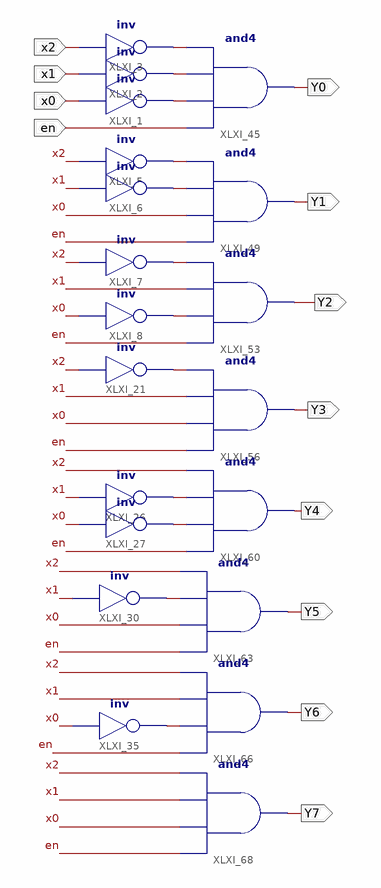
[diagram p0: schematic sheet 1]
// Xilinx ISE schematic decoder_3_to_8_en.sch (virtex6) as structural Verilog: 20 symbols, 12 ports
module decoder_3_to_8_en (
  input  x0,
  input  x1,
  input  x2,
  input  en,
  output Y0,
  output Y1,
  output Y2,
  output Y3,
  output Y4,
  output Y5,
  output Y6,
  output Y7
);

  wire XLXN_1, XLXN_2, XLXN_3, XLXN_5, XLXN_6, XLXN_7, XLXN_9, XLXN_14, XLXN_17, XLXN_30, XLXN_43, XLXN_89;

  not XLXI_1 (XLXN_3, x0);
  not XLXI_2 (XLXN_5, x1);
  not XLXI_3 (XLXN_6, x2);
  and XLXI_45 (Y0, en, XLXN_3, XLXN_5, XLXN_6);
  not XLXI_5 (XLXN_1, x2);
  not XLXI_6 (XLXN_2, x1);
  not XLXI_7 (XLXN_7, x2);
  not XLXI_8 (XLXN_9, x0);
  and XLXI_49 (Y1, en, x0, XLXN_2, XLXN_1);
  and XLXI_53 (Y2, en, XLXN_9, x1, XLXN_7);
  not XLXI_21 (XLXN_89, x2);
  not XLXI_26 (XLXN_14, x1);
  not XLXI_27 (XLXN_30, x0);
  and XLXI_56 (Y3, en, x0, x1, XLXN_89);
  not XLXI_30 (XLXN_17, x1);
  not XLXI_35 (XLXN_43, x0);
  and XLXI_63 (Y5, en, x0, XLXN_17, x2);
  and XLXI_66 (Y6, en, XLXN_43, x1, x2);
  and XLXI_68 (Y7, en, x0, x1, x2);
  and XLXI_60 (Y4, en, XLXN_30, XLXN_14, x2);
endmodule
